# EAGLE schematic rev2 (EAGLE 7.6.0)

## Sheet 1 of 7: MicroController
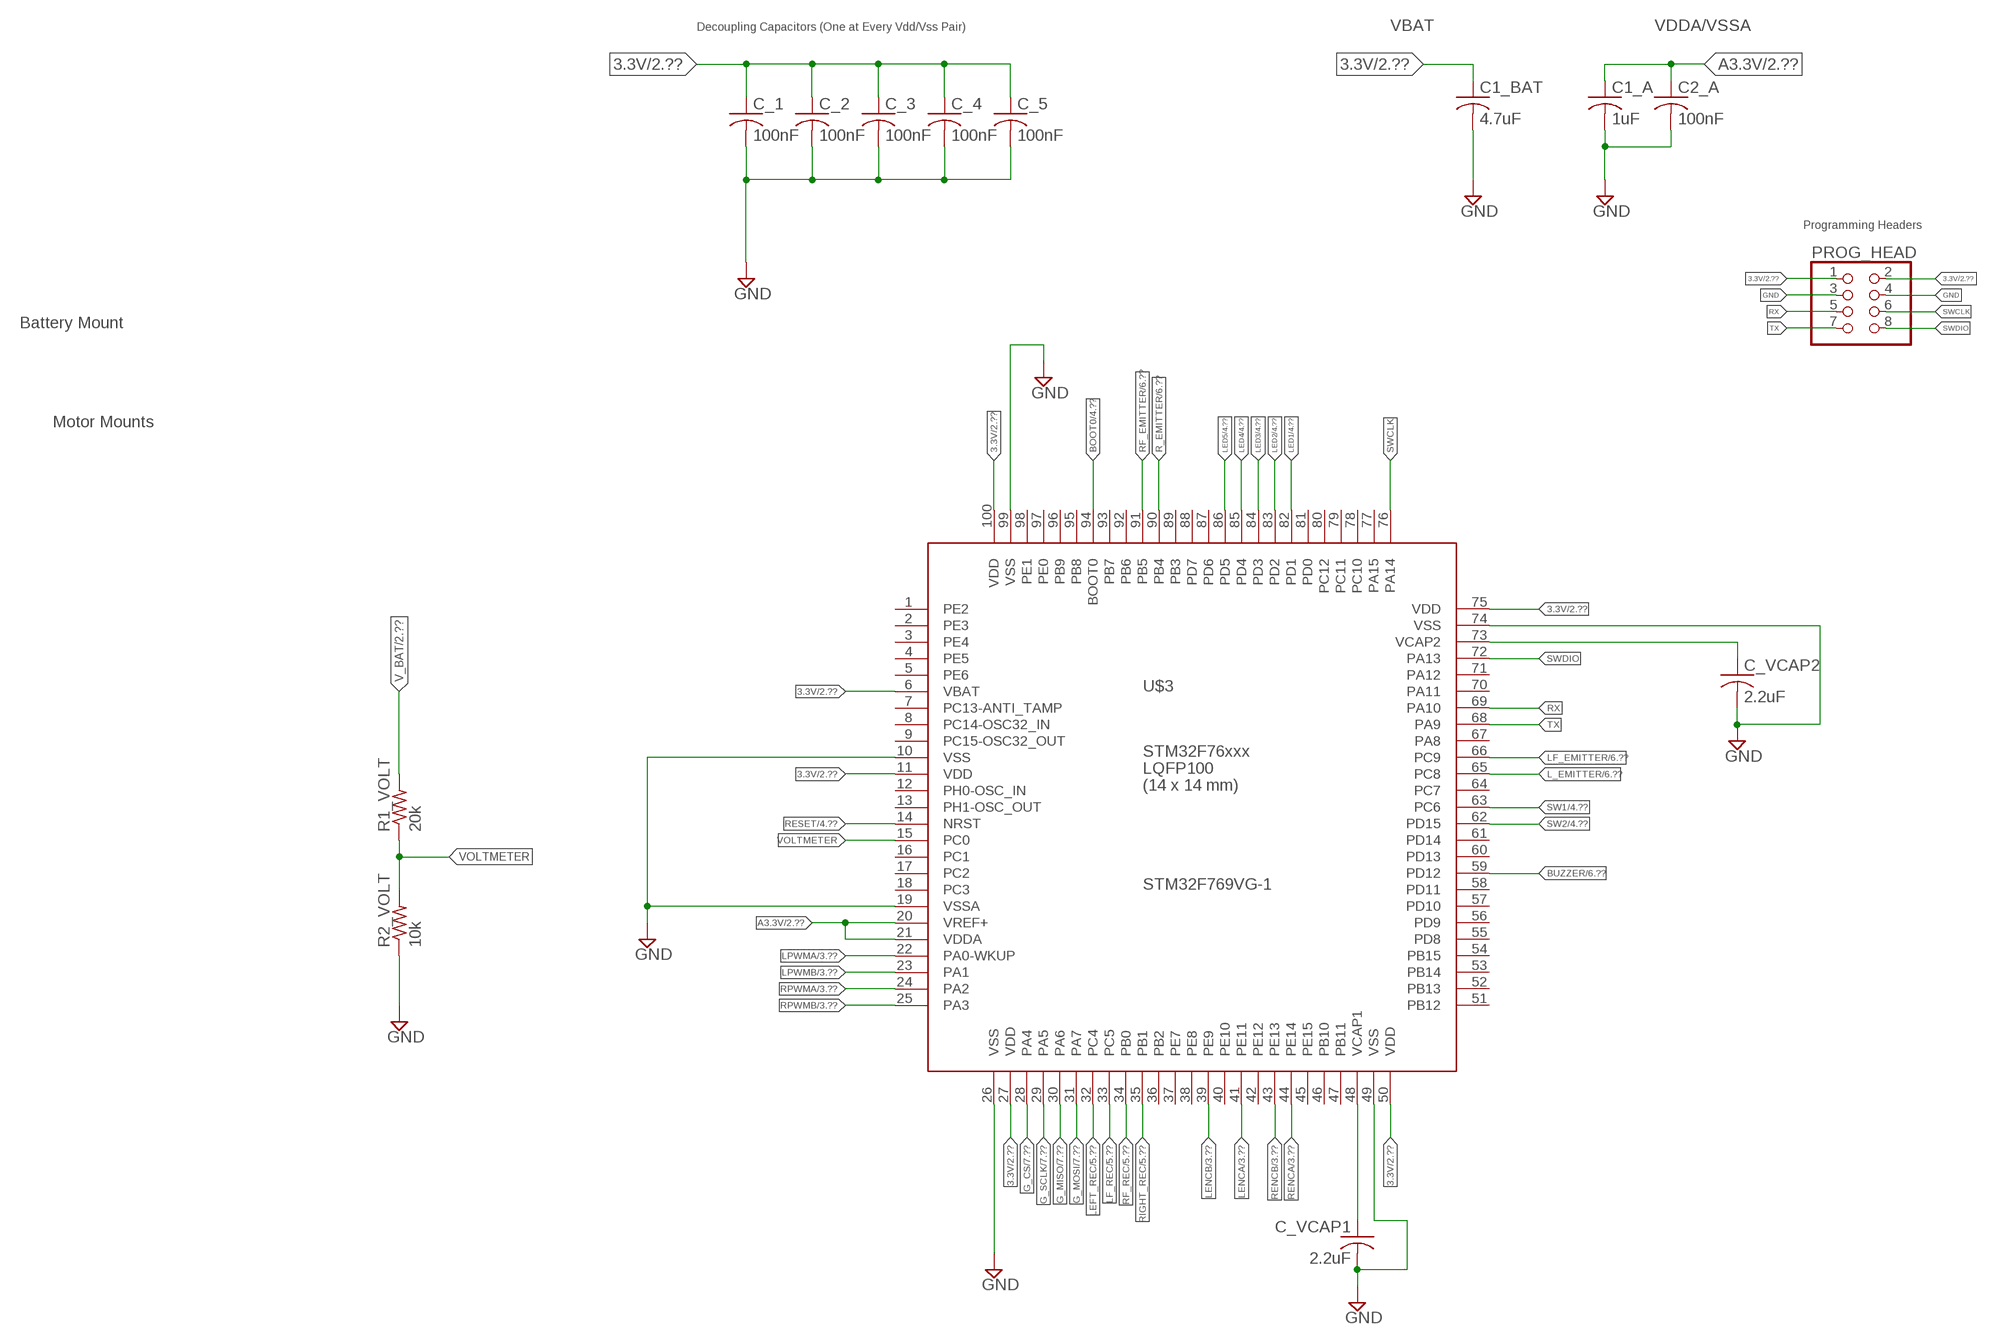
[diagram p0: schematic, sheet 1]

### Parts
C1_A  1uF  C-USC0603  [C0603]
C1_BAT  4.7uF  C-USC0603  [C0603]
C2_A  100nF  C-USC0603  [C0603]
C_1  100nF  C-USC0603  [C0603]
C_2  100nF  C-USC0603  [C0603]
C_3  100nF  C-USC0603  [C0603]
C_4  100nF  C-USC0603  [C0603]
C_5  100nF  C-USC0603  [C0603]
C_VCAP1  2.2uF  C-USC0603  [C0603]
C_VCAP2  2.2uF  C-USC0603  [C0603]
PROG_HEAD  PINHD-2X4  [2X04]
R1_VOLT  20k  R-US_R0603  [R0603]
R2_VOLT  10k  R-US_R0603  [R0603]
U$2  MOTOR  [MOTOR_MOUNT]
U$3  STM32F769VG-1  [LQFP100]
U$5  MOTOR  [MOTOR_MOUNT]

### Nets
3.3V: C1_BAT.1 C_1.1 C_2.1 C_3.1 C_4.1 C_5.1 PROG_HEAD.1 PROG_HEAD.2 U$3.6(VBAT) U$3.11(VDD) U$3.27(VDD) U$3.50(VDD) U$3.75(VDD) U$3.100(VDD) ; also sheet 2,4,6
A3.3V: C1_A.1 C2_A.1 U$3.20(VREF+) U$3.21(VDDA) ; also sheet 2,5,7
BOOT0: U$3.94(BOOT0) ; also sheet 4
BUZZER: U$3.59(PD12) ; also sheet 6
G_CS: U$3.28(PA4) ; also sheet 7
G_MISO: U$3.30(PA6) ; also sheet 7
G_MOSI: U$3.31(PA7) ; also sheet 7
G_SCLK: U$3.29(PA5) ; also sheet 7
GND: C1_A.2 C1_BAT.2 C2_A.2 C_1.2 C_2.2 C_3.2 C_4.2 C_5.2 C_VCAP1.2 C_VCAP2.2 PROG_HEAD.3 PROG_HEAD.4 R2_VOLT.1 U$3.10(VSS) U$3.19(VSSA) U$3.26(VSS) U$3.49(VSS) U$3.74(VSS) U$3.99(VSS) ; also sheet 2,3,4,5,6,7
L_EMITTER: U$3.65(PC8) ; also sheet 6
LED1: U$3.82(PD1) ; also sheet 4
LED2: U$3.83(PD2) ; also sheet 4
LED3: U$3.84(PD3) ; also sheet 4
LED4: U$3.85(PD4) ; also sheet 4
LED5: U$3.86(PD5) ; also sheet 4
LEFT_REC: U$3.32(PC4) ; also sheet 5
LENCA: U$3.41(PE11) ; also sheet 3
LENCB: U$3.39(PE9) ; also sheet 3
LF_EMITTER: U$3.66(PC9) ; also sheet 6
LF_REC: U$3.33(PC5) ; also sheet 5
LPWMA: U$3.22(PA0-WKUP) ; also sheet 3
LPWMB: U$3.23(PA1) ; also sheet 3
N$56: C_VCAP2.1 U$3.73(VCAP2)
N$57: C_VCAP1.1 U$3.48(VCAP1)
R_EMITTER: U$3.90(PB4) ; also sheet 6
RENCA: U$3.44(PE14) ; also sheet 3
RENCB: U$3.43(PE13) ; also sheet 3
RESET: U$3.14(NRST) ; also sheet 4
RF_EMITTER: U$3.91(PB5) ; also sheet 6
RF_REC: U$3.34(PB0) ; also sheet 5
RIGHT_REC: U$3.35(PB1) ; also sheet 5
RPWMA: U$3.24(PA2) ; also sheet 3
RPWMB: U$3.25(PA3) ; also sheet 3
RX: PROG_HEAD.5 U$3.69(PA10)
SW1: U$3.63(PC6) ; also sheet 4
SW2: U$3.62(PD15) ; also sheet 4
SWCLK: PROG_HEAD.6 U$3.76(PA14)
SWDIO: PROG_HEAD.8 U$3.72(PA13)
TX: PROG_HEAD.7 U$3.68(PA9)
V_BAT: R1_VOLT.2 ; also sheet 2,3
VOLTMETER: R1_VOLT.1 R2_VOLT.2 U$3.15(PC0)
Unconnected: U$3.1(PE2) U$3.2(PE3) U$3.3(PE4) U$3.4(PE5) U$3.5(PE6) U$3.7(PC13-ANTI_TAMP) U$3.8(PC14-OSC32_IN) U$3.9(PC15-OSC32_OUT) U$3.12(PH0-OSC_IN) U$3.13(PH1-OSC_OUT) U$3.16(PC1) U$3.17(PC2) U$3.18(PC3) U$3.36(PB2) U$3.37(PE7) U$3.38(PE8) U$3.40(PE10) U$3.42(PE12) U$3.45(PE15) U$3.46(PB10) U$3.47(PB11) U$3.51(PB12) U$3.52(PB13) U$3.53(PB14) U$3.54(PB15) U$3.55(PD8) U$3.56(PD9) U$3.57(PD10) U$3.58(PD11) U$3.60(PD13) U$3.61(PD14) U$3.64(PC7) U$3.67(PA8) U$3.70(PA11) U$3.71(PA12) U$3.77(PA15) U$3.78(PC10) U$3.79(PC11) U$3.80(PC12) U$3.81(PD0) U$3.87(PD6) U$3.88(PD7) U$3.89(PB3) U$3.92(PB6) U$3.93(PB7) U$3.95(PB8) U$3.96(PB9) U$3.97(PE0) U$3.98(PE1)

### Notes on the sheet
- Decoupling Capacitors (One at Every Vdd/Vss Pair) | VBAT | VDDA/VSSA
- Programming Headers
- Battery Mount
- Motor Mounts

## Sheet 2 of 7: Power Supply
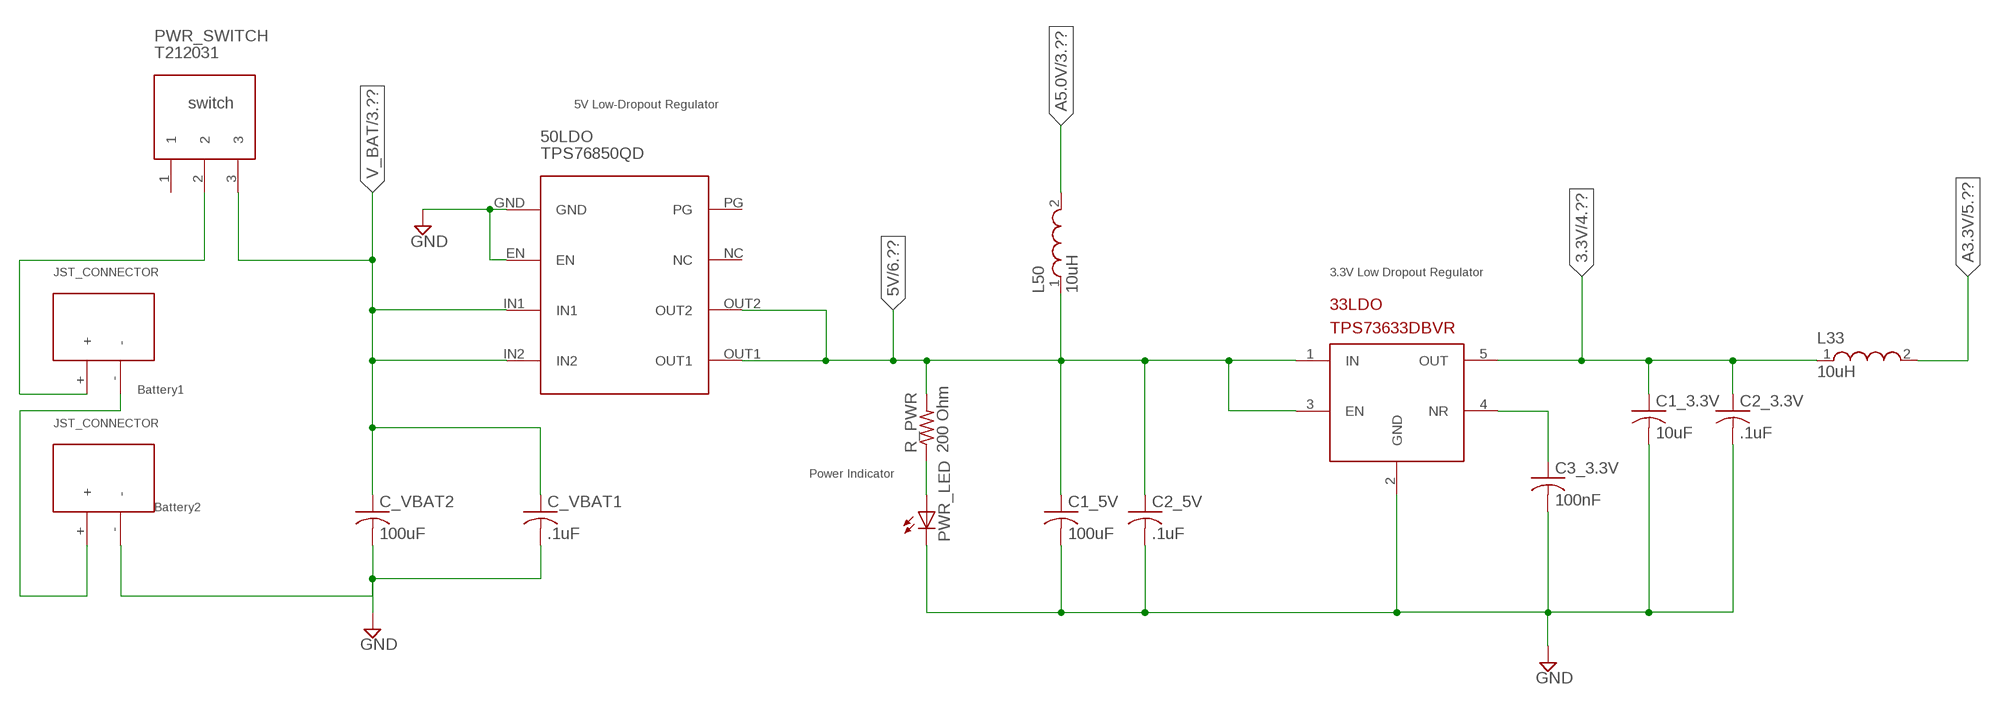
[diagram p1: schematic, sheet 2]

### Parts
33LDO  TPS73633DBVR  [SOT23-DBV]
50LDO  TPS76850QD  TPS76850  [8-SOIC(SMT)]
C1_3.3V  10uF  C-USC0603  [C0603]
C1_5V  100uF  C-USC0603  [C0603]
C2_3.3V  .1uF  C-USC0603  [C0603]
C2_5V  .1uF  C-USC0603  [C0603]
C3_3.3V  100nF  C-USC0603  [C0603]
C_VBAT1  .1uF  C-USC0603  [C0603]
C_VBAT2  100uF  C-USC1206  [C1206]
L33  10uH  WE-MI_0805  [WE-MI_0805]
L50  10uH  WE-MI_0805  [WE-MI_0805]
PWR_LED  LEDCHIPLED_0805  [CHIPLED_0805]
PWR_SWITCH  T212031  [T212031]
R_PWR  200 Ohm  R-US_R0603  [R0603]
U$7  JST_CONNECTOR_FEMALE  [JST_CONNECTOR_FEMALE]
U$8  JST_CONNECTOR_FEMALE  [JST_CONNECTOR_FEMALE]

### Nets
3.3V: 33LDO.5(OUT) C1_3.3V.1 C2_3.3V.1 L33.1 ; also sheet 1,4,6
5V: 33LDO.1(IN) 33LDO.3(EN) 50LDO.OUT1 50LDO.OUT2 C1_5V.1 C2_5V.1 L50.1 R_PWR.2 ; also sheet 6
A3.3V: L33.2 ; also sheet 1,5,7
A5.0V: L50.2 ; also sheet 3
GND: 33LDO.2(GND) 50LDO.EN 50LDO.GND C1_3.3V.2 C1_5V.2 C2_3.3V.2 C2_5V.2 C3_3.3V.2 C_VBAT1.2 C_VBAT2.2 PWR_LED.C U$8.- ; also sheet 1,3,4,5,6,7
N$1: PWR_LED.A R_PWR.1
N$2: 33LDO.4(NR) C3_3.3V.1
N$9: U$7.- U$8.+
N$31: PWR_SWITCH.2 U$7.+
V_BAT: 50LDO.IN1 50LDO.IN2 C_VBAT1.1 C_VBAT2.1 PWR_SWITCH.3 ; also sheet 1,3
Unconnected: 50LDO.NC 50LDO.PG PWR_SWITCH.1

### Notes on the sheet
- switch | 5V Low-Dropout Regulator
- 3.3V Low Dropout Regulator
- Battery1
- Power Indicator
- Battery2

## Sheet 3 of 7: Motor Control
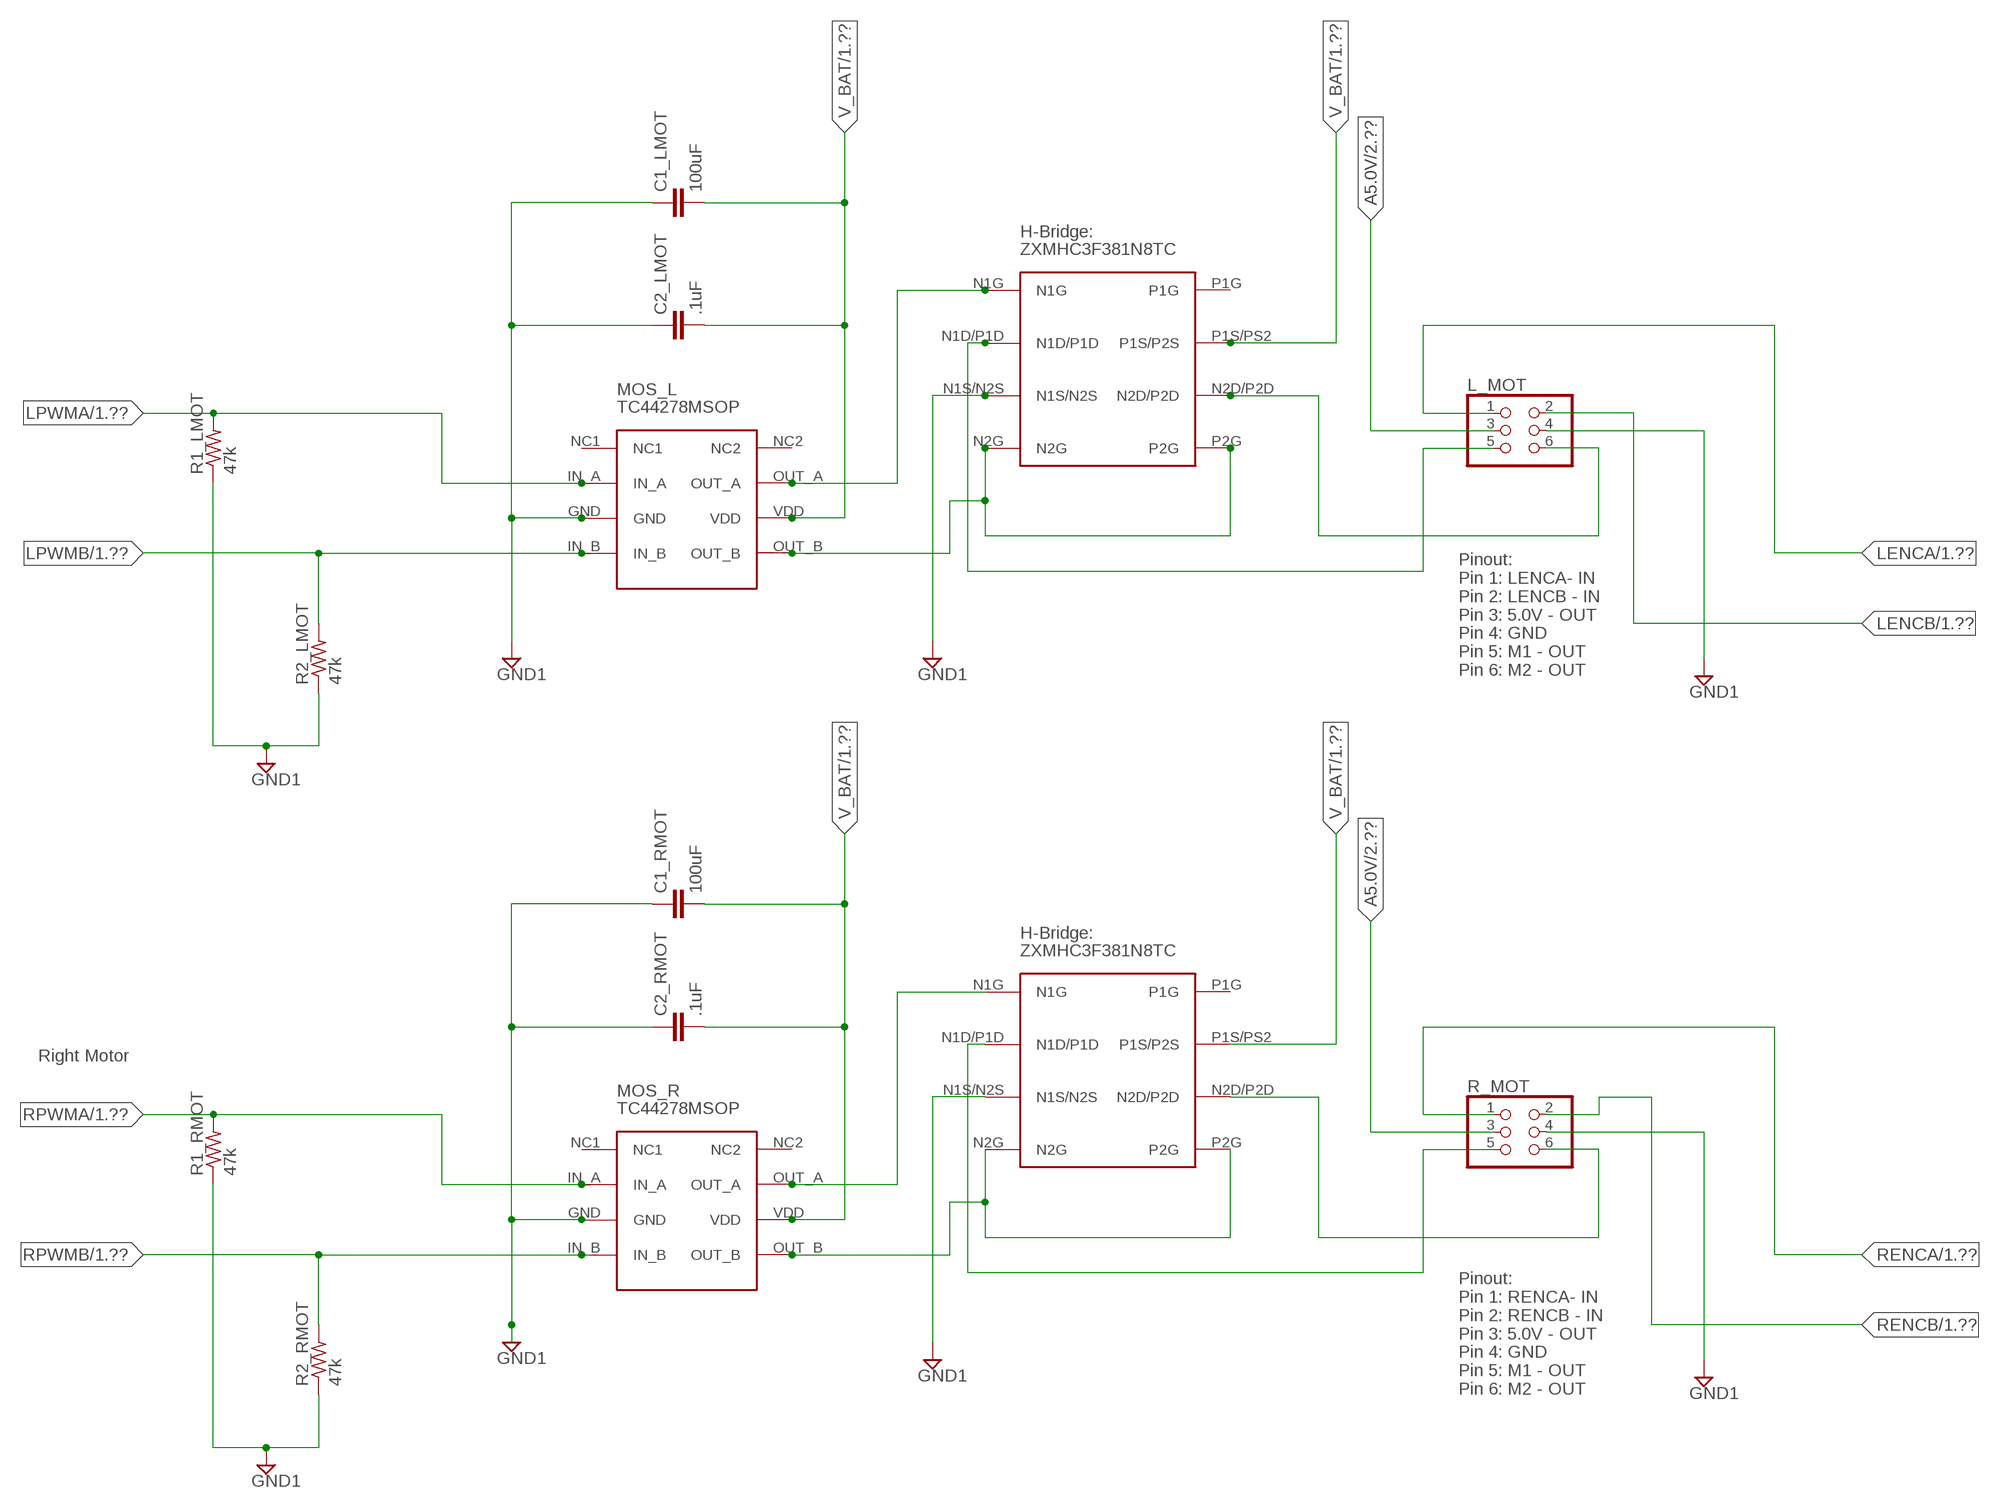
[diagram p2: schematic, sheet 3]

### Parts
C1_LMOT  100uF  C-EUC0805  [C0805]
C1_RMOT  100uF  C-EUC0805  [C0805]
C2_LMOT  .1uF  C-EUC0805  [C0805]
C2_RMOT  .1uF  C-EUC0805  [C0805]
HB_L  ZXMHC3F381N8TC  [8-SOIC]
HB_R  ZXMHC3F381N8TC  [8-SOIC]
L_MOT  PINHD-2X3  [2X03]
MOS_L  TC44278MSOP  [TC44278MSOP]
MOS_R  TC44278MSOP  [TC44278MSOP]
R1_LMOT  47k  R-US_R0603  [R0603]
R1_RMOT  47k  R-US_R0603  [R0603]
R2_LMOT  47k  R-US_R0603  [R0603]
R2_RMOT  47k  R-US_R0603  [R0603]
R_MOT  PINHD-2X3  [2X03]

### Nets
A5.0V: L_MOT.3 R_MOT.3 ; also sheet 2
GND: C1_LMOT.1 C1_RMOT.1 C2_LMOT.1 C2_RMOT.1 HB_L.N1S/N2S HB_R.N1S/N2S L_MOT.4 MOS_L.GND MOS_R.GND R1_LMOT.1 R1_RMOT.1 R2_LMOT.1 R2_RMOT.1 R_MOT.4 ; supply symbol labelled GND1 ; also sheet 1,2,4,5,6,7
LENCA: L_MOT.1 ; also sheet 1
LENCB: L_MOT.2 ; also sheet 1
LPWMA: MOS_L.IN_A R1_LMOT.2 ; also sheet 1
LPWMB: MOS_L.IN_B R2_LMOT.2 ; also sheet 1
N$5: HB_L.N1G MOS_L.OUT_A
N$6: HB_L.N2G HB_L.P2G MOS_L.OUT_B
N$8: HB_L.N1D/P1D L_MOT.5
N$11: HB_L.N2D/P2D L_MOT.6
N$17: HB_R.N1G MOS_R.OUT_A
N$18: HB_R.N2G HB_R.P2G MOS_R.OUT_B
N$19: HB_R.N1D/P1D R_MOT.5
N$21: HB_R.N2D/P2D R_MOT.6
RENCA: R_MOT.1 ; also sheet 1
RENCB: R_MOT.2 ; also sheet 1
RPWMA: MOS_R.IN_A R1_RMOT.2 ; also sheet 1
RPWMB: MOS_R.IN_B R2_RMOT.2 ; also sheet 1
V_BAT: C1_LMOT.2 C1_RMOT.2 C2_LMOT.2 C2_RMOT.2 HB_L.P1S/PS2(P1S/P2S) HB_R.P1S/PS2(P1S/P2S) MOS_L.VDD MOS_R.VDD ; also sheet 1,2
Unconnected: HB_L.P1G HB_R.P1G MOS_L.NC1 MOS_L.NC2 MOS_R.NC1 MOS_R.NC2

### Notes on the sheet
- Pinout:
  Pin 1: LENCA- IN
  Pin 2: LENCB - IN
  Pin 3: 5.0V - OUT
  Pin 4: GND
  Pin 5: M1 - OUT
  Pin 6: M2 - OUT
- Right Motor
- Pinout:
  Pin 1: RENCA- IN
  Pin 2: RENCB - IN
  Pin 3: 5.0V - OUT
  Pin 4: GND
  Pin 5: M1 - OUT
  Pin 6: M2 - OUT

## Sheet 4 of 7: LED's and Buttons
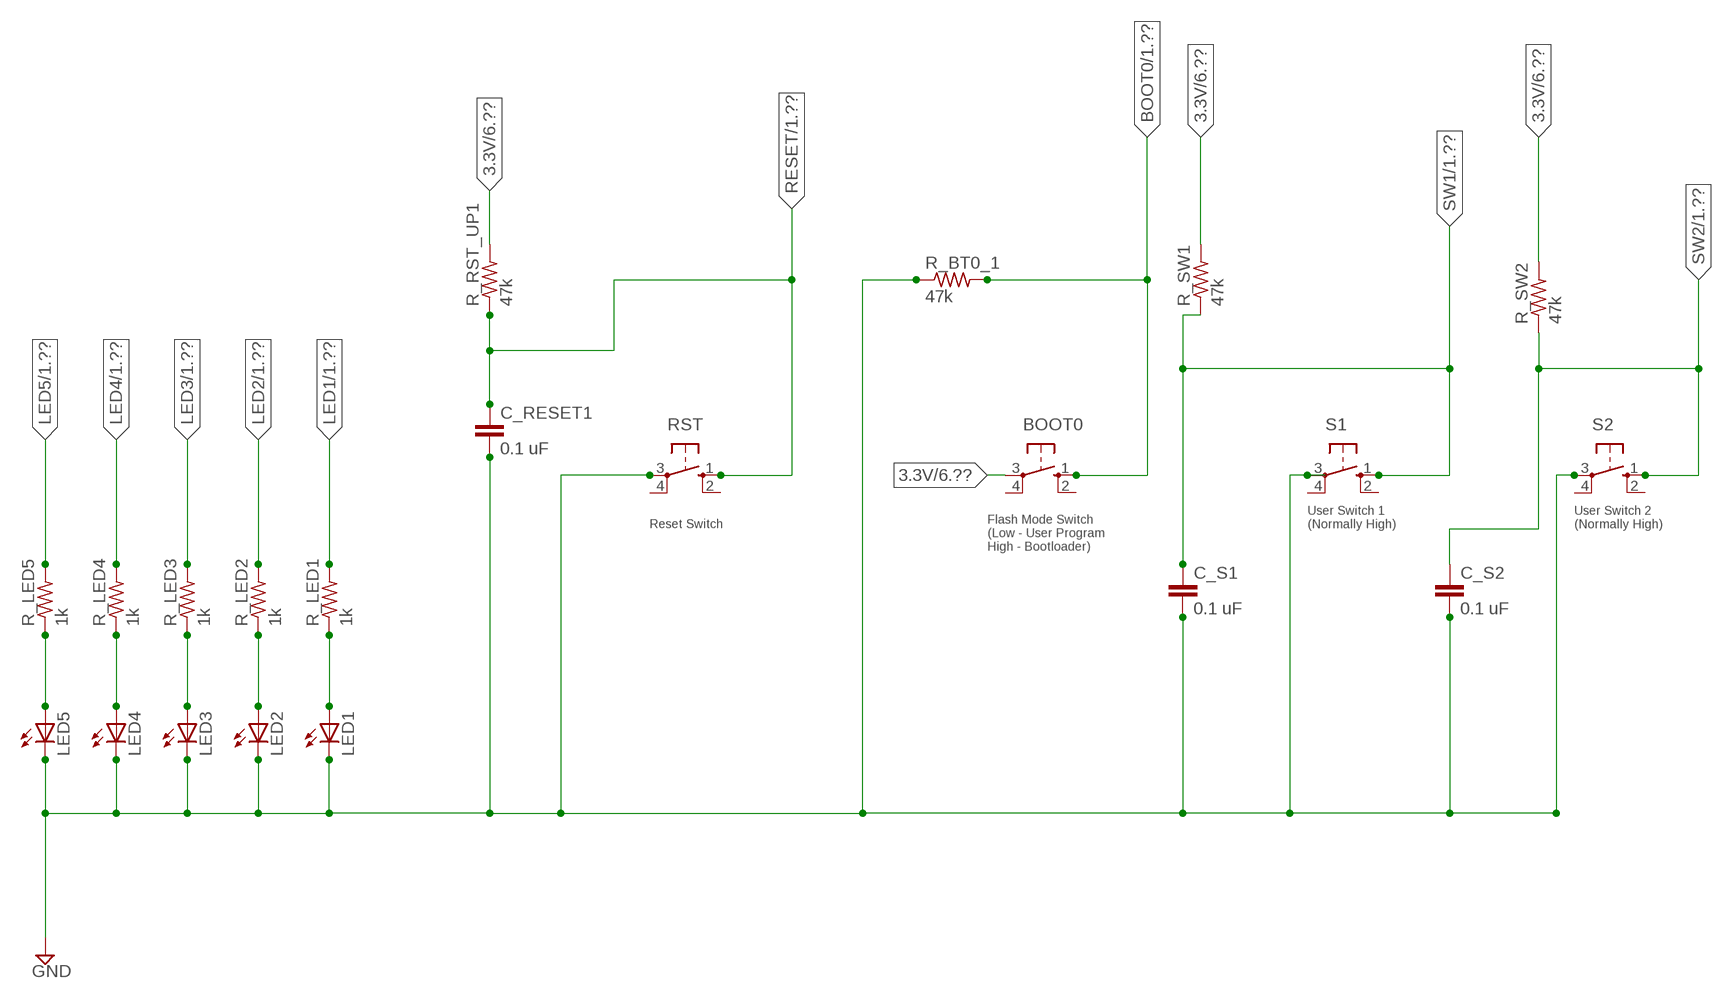
[diagram p3: schematic, sheet 4]

### Parts
BOOT0  10-XX  [B3F-10XX]
C_RESET1  0.1 uF  C-EUC0603  [C0603]
C_S1  0.1 uF  C-EUC0603  [C0603]
C_S2  0.1 uF  C-EUC0603  [C0603]
LED1  LEDCHIPLED_0805  [CHIPLED_0805]
LED2  LEDCHIPLED_0805  [CHIPLED_0805]
LED3  LEDCHIPLED_0805  [CHIPLED_0805]
LED4  LEDCHIPLED_0805  [CHIPLED_0805]
LED5  LEDCHIPLED_0805  [CHIPLED_0805]
R_BT0_1  47k  R-US_R0603  [R0603]
R_LED1  1k  R-US_R0603  [R0603]
R_LED2  1k  R-US_R0603  [R0603]
R_LED3  1k  R-US_R0603  [R0603]
R_LED4  1k  R-US_R0603  [R0603]
R_LED5  1k  R-US_R0603  [R0603]
R_RST_UP1  47k  R-US_R0603  [R0603]
R_SW1  47k  R-US_R0603  [R0603]
R_SW2  47k  R-US_R0603  [R0603]
RST  10-XX  [B3F-10XX]
S1  10-XX  [B3F-10XX]
S2  10-XX  [B3F-10XX]

### Nets
3.3V: BOOT0.3(P) R_RST_UP1.2 R_SW1.2 R_SW2.2 ; also sheet 1,2,6
BOOT0: BOOT0.1(S) R_BT0_1.2 ; also sheet 1
GND: C_RESET1.2 C_S1.2 C_S2.2 LED1.C LED2.C LED3.C LED4.C LED5.C R_BT0_1.1 RST.3(P) S1.3(P) S2.3(P) ; also sheet 1,2,3,5,6,7
LED1: R_LED1.2 ; also sheet 1
LED2: R_LED2.2 ; also sheet 1
LED3: R_LED3.2 ; also sheet 1
LED4: R_LED4.2 ; also sheet 1
LED5: R_LED5.2 ; also sheet 1
N$40: LED1.A R_LED1.1
N$41: LED2.A R_LED2.1
N$42: LED3.A R_LED3.1
N$43: LED4.A R_LED4.1
N$44: LED5.A R_LED5.1
RESET: C_RESET1.1 R_RST_UP1.1 RST.1(S) ; also sheet 1
SW1: C_S1.1 R_SW1.1 S1.1(S) ; also sheet 1
SW2: C_S2.1 R_SW2.1 S2.1(S) ; also sheet 1
Unconnected: BOOT0.2(S1) BOOT0.4(P1) RST.2(S1) RST.4(P1) S1.2(S1) S1.4(P1) S2.2(S1) S2.4(P1)

### Notes on the sheet
- Reset Switch
- User Switch 1
  (Normally High)
- User Switch 2
  (Normally High)
- Flash Mode Switch
  (Low - User Program
  High - Bootloader)

## Sheet 5 of 7: Infrared Receivers
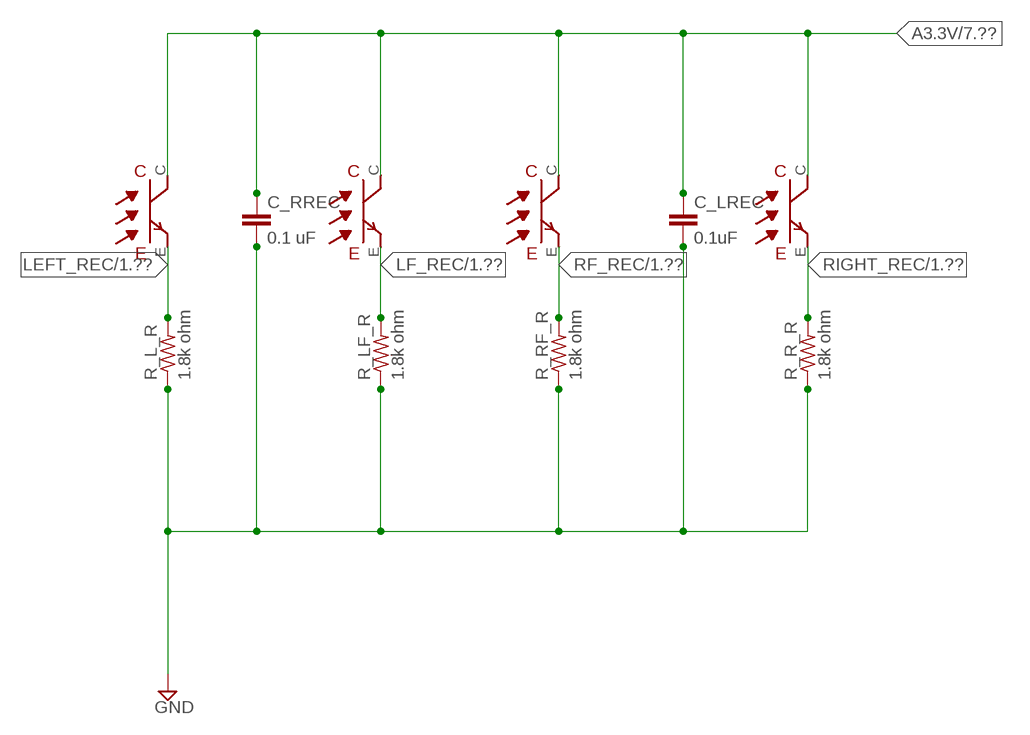
[diagram p4: schematic, sheet 5]

### Parts
C_LREC  0.1uF  C-EUC0603  [C0603]
C_RREC  0.1 uF  C-EUC0603  [C0603]
L_REC  RECEIVER  [RECEIVER]
LF_REC  RECEIVER  [RECEIVER]
R_L_R  1.8k ohm  R-US_R0603  [R0603]
R_LF_R  1.8k ohm  R-US_R0603  [R0603]
R_R_R  1.8k ohm  R-US_R0603  [R0603]
R_REC  RECEIVER  [RECEIVER]
R_RF_R  1.8k ohm  R-US_R0603  [R0603]
RF_REC  RECEIVER  [RECEIVER]

### Nets
A3.3V: C_LREC.1 C_RREC.1 L_REC.C LF_REC.C R_REC.C RF_REC.C ; also sheet 1,2,7
GND: C_LREC.2 C_RREC.2 R_L_R.1 R_LF_R.1 R_R_R.1 R_RF_R.1 ; also sheet 1,2,3,4,6,7
LEFT_REC: L_REC.E R_L_R.2 ; also sheet 1
LF_REC: LF_REC.E R_LF_R.2 ; also sheet 1
RF_REC: R_RF_R.2 RF_REC.E ; also sheet 1
RIGHT_REC: R_R_R.2 R_REC.E ; also sheet 1

## Sheet 6 of 7: Infrared Emitters
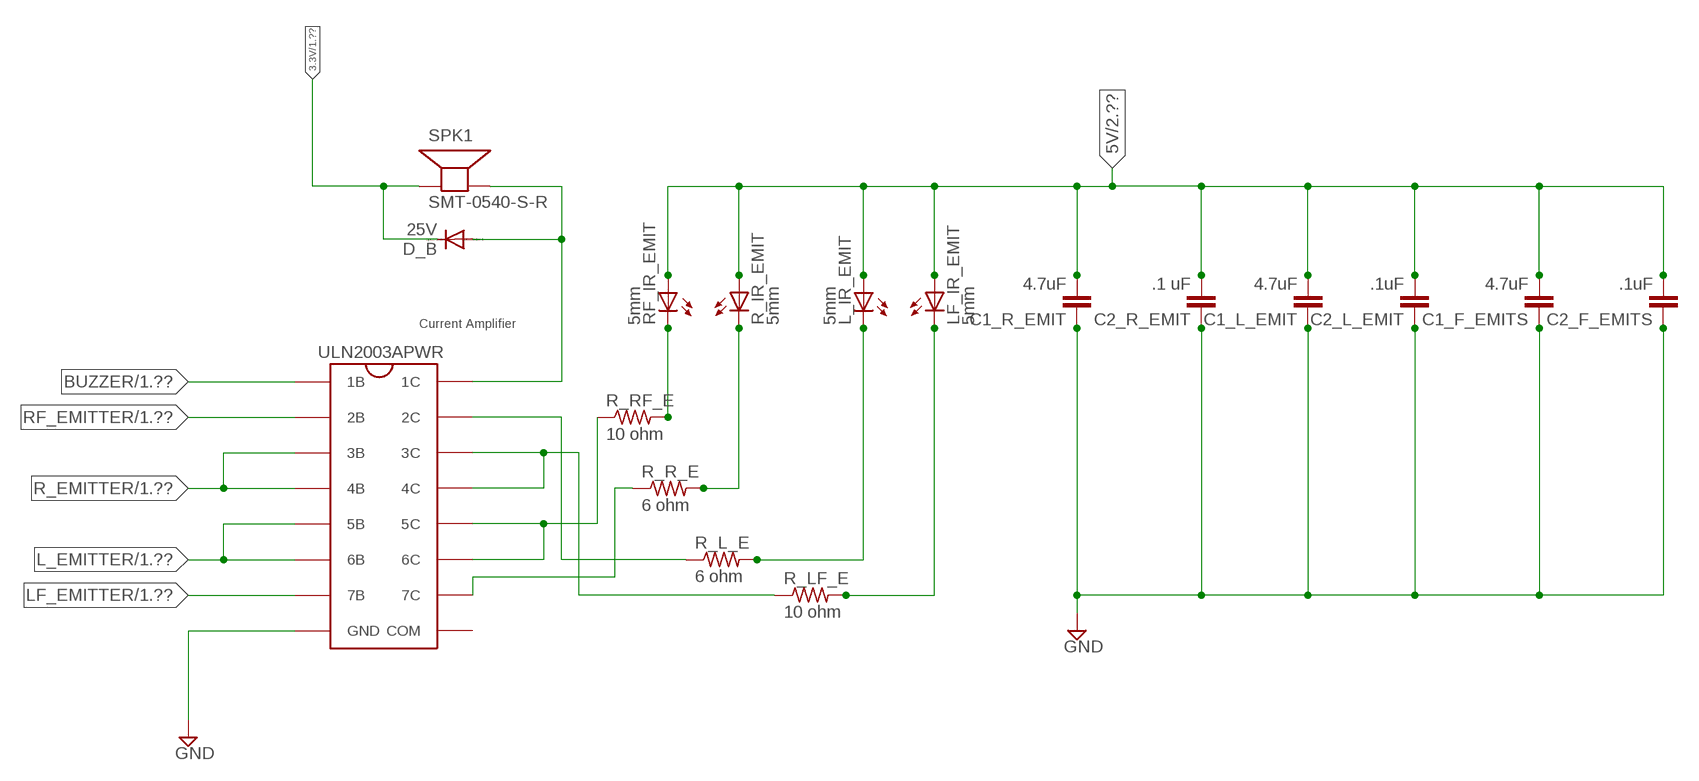
[diagram p5: schematic, sheet 6]

### Parts
C1_F_EMITS  4.7uF  C-EUC0603  [C0603]
C1_L_EMIT  4.7uF  C-EUC0603  [C0603]
C1_R_EMIT  4.7uF  C-EUC0603  [C0603]
C2_F_EMITS  .1uF  C-EUC0603  [C0603]
C2_L_EMIT  .1uF  C-EUC0603  [C0603]
C2_R_EMIT  .1 uF  C-EUC0603  [C0603]
D_B  25V  DIODE-SOD123  [SOD123]
L_IR_EMIT  5mm  LED5MM  [LED5MM]
LF_IR_EMIT  5mm  LED5MM  [LED5MM]
R_IR_EMIT  5mm  LED5MM  [LED5MM]
R_L_E  6 ohm  R-US_R0603  [R0603]
R_LF_E  10 ohm  R-US_R0603  [R0603]
R_R_E  6 ohm  R-US_R0603  [R0603]
R_RF_E  10 ohm  R-US_R0603  [R0603]
RF_IR_EMIT  5mm  LED5MM  [LED5MM]
SPK1  SMT-0540-S-R  [SMT-0540-S-R]
U$9  ULN2003APWR  [ULN2003APWR]

### Nets
3.3V: D_B.C SPK1.-(+) ; also sheet 1,2,4
5V: C1_F_EMITS.2 C1_L_EMIT.2 C1_R_EMIT.2 C2_F_EMITS.2 C2_L_EMIT.2 C2_R_EMIT.2 L_IR_EMIT.A LF_IR_EMIT.A R_IR_EMIT.A RF_IR_EMIT.A ; also sheet 2
BUZZER: U$9.1B ; also sheet 1
GND: C1_F_EMITS.1 C1_L_EMIT.1 C1_R_EMIT.1 C2_F_EMITS.1 C2_L_EMIT.1 C2_R_EMIT.1 U$9.GND ; also sheet 1,2,3,4,5,7
L_EMITTER: U$9.5B U$9.6B ; also sheet 1
LF_EMITTER: U$9.7B ; also sheet 1
N$4: R_L_E.1 U$9.2C
N$13: R_R_E.1 U$9.7C
N$23: R_RF_E.2 RF_IR_EMIT.K(C)
N$24: R_LF_E.1 U$9.3C U$9.4C
N$25: R_IR_EMIT.K(C) R_R_E.2
N$26: L_IR_EMIT.K(C) R_L_E.2
N$27: R_RF_E.1 U$9.5C U$9.6C
N$28: LF_IR_EMIT.K(C) R_LF_E.2
N$29: D_B.A SPK1.+(-) U$9.1C
R_EMITTER: U$9.3B U$9.4B ; also sheet 1
RF_EMITTER: U$9.2B ; also sheet 1
Unconnected: U$9.COM

### Notes on the sheet
- Current Amplifier

## Sheet 7 of 7: Gyroscope
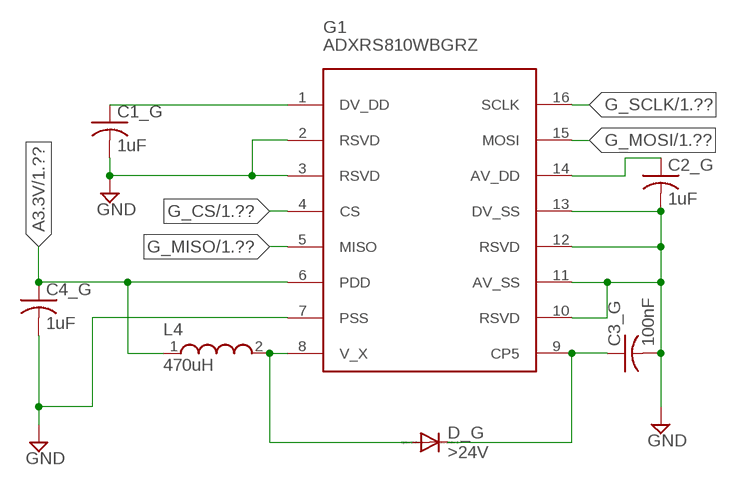
[diagram p6: schematic, sheet 7]

### Parts
C1_G  1uF  C-USC0603  [C0603]
C2_G  1uF  C-USC0603  [C0603]
C3_G  100nF  C-USC0603  [C0603]
C4_G  1uF  C-USC0603  [C0603]
D_G  >24V  DIODE-SOD123  [SOD123]
G1  ADXRS810  [SOIC-16]
L4  470uH  WE-MI_0805  [WE-MI_0805]

### Nets
A3.3V: C4_G.1 G1.6(PDD) L4.1 ; also sheet 1,2,5
G_CS: G1.4(CS) ; also sheet 1
G_MISO: G1.5(MISO) ; also sheet 1
G_MOSI: G1.15(MOSI) ; also sheet 1
G_SCLK: G1.16(SCLK) ; also sheet 1
GND: C1_G.2 C2_G.2 C3_G.2 C4_G.2 G1.2(RSVD) G1.3(RSVD) G1.7(PSS) G1.10(RSVD) G1.11(AV_SS) G1.12(RSVD) G1.13(DV_SS) ; also sheet 1,2,3,4,5,6
N$10: C1_G.1 G1.1(DV_DD)
N$14: D_G.A G1.8(V_X) L4.2
N$20: C3_G.1 D_G.C G1.9(CP5)
N$35: C2_G.1 G1.14(AV_DD)

## Library data of the parts
33LDO = TPSRegulators:TPS73633DBVR: 3.3V LDO regulator. Package footprint not verified!!; AVAILABILITY: Good; DESCRIPTION: Single Output LDO, 400mA, Adj.(1.2 to 5.5V), Cap free, Low Noise, Reverse Current Protection 5-SOT-23 -40 to 125; MF: Texas Instruments; MP: TPS73633DBVR; PACKAGE: SOT-23 Texas Instruments; PRICE: 1.34 USD
50LDO = TPSRegulators:TPS76850
BOOT0 RST S1 S2 = switch-omron:10-XX: OMRON SWITCH; MPN: B3F-1000; OC_FARNELL: 176432; OC_NEWARK: 36M3542
C1_3.3V C1_5V C2_3.3V C2_5V C3_3.3V C_VBAT1 C_VBAT2 = resistor:C-US: CAPACITOR, American symbol
C1_A C1_BAT C1_G C2_A C2_G C3_G C4_G C_1-C_5 C_VCAP1 C_VCAP2 = rcl:C-US: CAPACITOR, American symbol
C1_F_EMITS C1_L_EMIT C1_R_EMIT C2_F_EMITS C2_L_EMIT C2_R_EMIT C_LREC C_RESET1 C_RREC C_S1 C_S2 = resistor:C-EU: CAPACITOR, European symbol
C1_LMOT C1_RMOT C2_LMOT C2_RMOT = rcl:C-EU: CAPACITOR, European symbol
D_B D_G = diode:DIODE-: DIODE
G1 = gyroscope:ADXRS810
HB_L HB_R = MMHbridge:ZXMHC3F381N8TC
L4 L33 L50 = EagleLibrary_Wuerth_Elektronik_eiSos_rev16a:WE-MI: SMD Multilayer Inductor Characteristics Smallest inductor possible for less space needed on the printed circuit board and therefore perfect suitable for high density mounting No cross coupling because of closed magnetic circuits No crosstalk Operating temperature: –55 °C to +125 °C Applications Filter circuits Oscillators Adjustment networks Discretely built T- or π-Filter <http://katalog.we-online.de/media/images/eisos/IndMI_pf2.jpg> Details see: http://katalog.we-online.de/en/pbs/WE-MI? Updated by Dan Xu 2014-07-08 2014 (C) Wurth Elektronik
L_IR_EMIT LED1-LED5 LF_IR_EMIT PWR_LED R_IR_EMIT RF_IR_EMIT = led:LED: LED OSRAM: - CHIPLED LG R971, LG N971, LY N971, LG Q971, LY Q971, LO R971, LY R971 LH N974, LH R974 LS Q976, LO Q976, LY Q976 LO Q996 - Hyper CHIPLED LW Q18S LB Q993, LB Q99A, LB R99A - SideLED LS A670, LO A670, LY A670, LG A670, LP A670 LB A673, LV A673, LT A673, LW A673 LH A674 LY A675 LS A676, LA A676, LO A676, LY A676, LW A676 LS A679, LY A679, LG A679 - Hyper Micro SIDELED® LS Y876, LA Y876, LO Y876, LY Y876 LT Y87S - SmartLED LW L88C, LW L88S LB L89C, LB L89S, LG L890 LS L89K, LO L89K, LY L89K LS L896, LA L896, LO L896, LY L896 - TOPLED LS T670, LO T670, LY T670, LG T670, LP T670 LSG T670, LSP T670, LSY T670, LOP T670, LYG T670 LG T671, LOG T671, LSG T671 LB T673, LV T673, LT T673, LW T673 LH T674 LS T676, LA T676, LO T676, LY T676, LB T676, LH T676, LSB T676, LW T676 LB T67C, LV T67C, LT T67C, LS T67K, LO T67K, LY T67K, LW E67C LS E67B, LA E67B, LO E67B, LY E67B, LB E67C, LV E67C, LT E67C LW T67C LS T679, LY T679, LG T679 LS T770, LO T770, LY T770, LG T770, LP T770 LB T773, LV T773, LT T773, LW T773 LH T774 LS E675, LA E675, LY E675, LS T675 LS T776, LA T776, LO T776, LY T776, LB T776 LHGB T686 LT T68C, LB T68C - Hyper Mini TOPLED® LB M676 - Mini TOPLED Santana® LG M470 LS M47K, LO M47K, LY M47K Source: http://www.osram.convergy.de LUXEON: - LUMILED® LXK2-PW12-R00, LXK2-PW12-S00, LXK2-PW14-U00, LXK2-PW14-V00 LXK2-PM12-R00, LXK2-PM12-S00, LXK2-PM14-U00 LXK2-PE12-Q00, LXK2-PE12-R00, LXK2-PE12-S00, LXK2-PE14-T00, LXK2-PE14-U00 LXK2-PB12-K00, LXK2-PB12-L00, LXK2-PB12-M00, LXK2-PB14-N00, LXK2-PB14-P00, LXK2-PB14-Q00 LXK2-PR12-L00, LXK2-PR12-M00, LXK2-PR14-Q00, LXK2-PR14-R00 LXK2-PD12-Q00, LXK2-PD12-R00, LXK2-PD12-S00 LXK2-PH12-R00, LXK2-PH12-S00 LXK2-PL12-P00, LXK2-PL12-Q00, LXK2-PL12-R00 Source: www.luxeon.com KINGBRIGHT: KA-3528ASYC Source: www.kingbright.com
L_MOT R_MOT = pinhead:PINHD-2X3: PIN HEADER
L_REC LF_REC R_REC RF_REC = sfh4550 & teft4300:RECEIVER
MOS_L MOS_R = MMmosfet:TC44278MSOP
PROG_HEAD = pinhead:PINHD-2X4: PIN HEADER
PWR_SWITCH = GCswitch:T212031
R1_LMOT R1_RMOT R1_VOLT R2_LMOT R2_RMOT R2_VOLT R_BT0_1 R_L_E R_L_R R_LED1-R_LED5 R_LF_E R_LF_R R_PWR R_R_E R_R_R R_RF_E R_RF_R R_RST_UP1 R_SW1 R_SW2 = resistor:R-US_: RESISTOR, American symbol
SPK1 = SMT-0540-S-R:SMT-0540-S-R: SMT-0549-S-R Small surface-mount magnetic buzzer; AVAILABILITY: Good; DESCRIPTION: Audio Indicator Transducer Electromagnetic 3Vp-p 100mA Solder Pad 2Vp-p 3500Hz to 4500Hz Surface Mount; MF: PUI Audio; MP: SMT-0540-S-R; PACKAGE: None; PRICE: 2.42 USD
U$2 U$5 = mounts:MOTOR
U$3 = MCU:STM32F769VG-1
U$7 U$8 = JST_CONNECTOR_FEMALE. through hole:JST_CONNECTOR_FEMALE
U$9 = ULN2003APWR:ULN2003APWR